# Altium project SC8701_EVM_RE1.PrjPcb
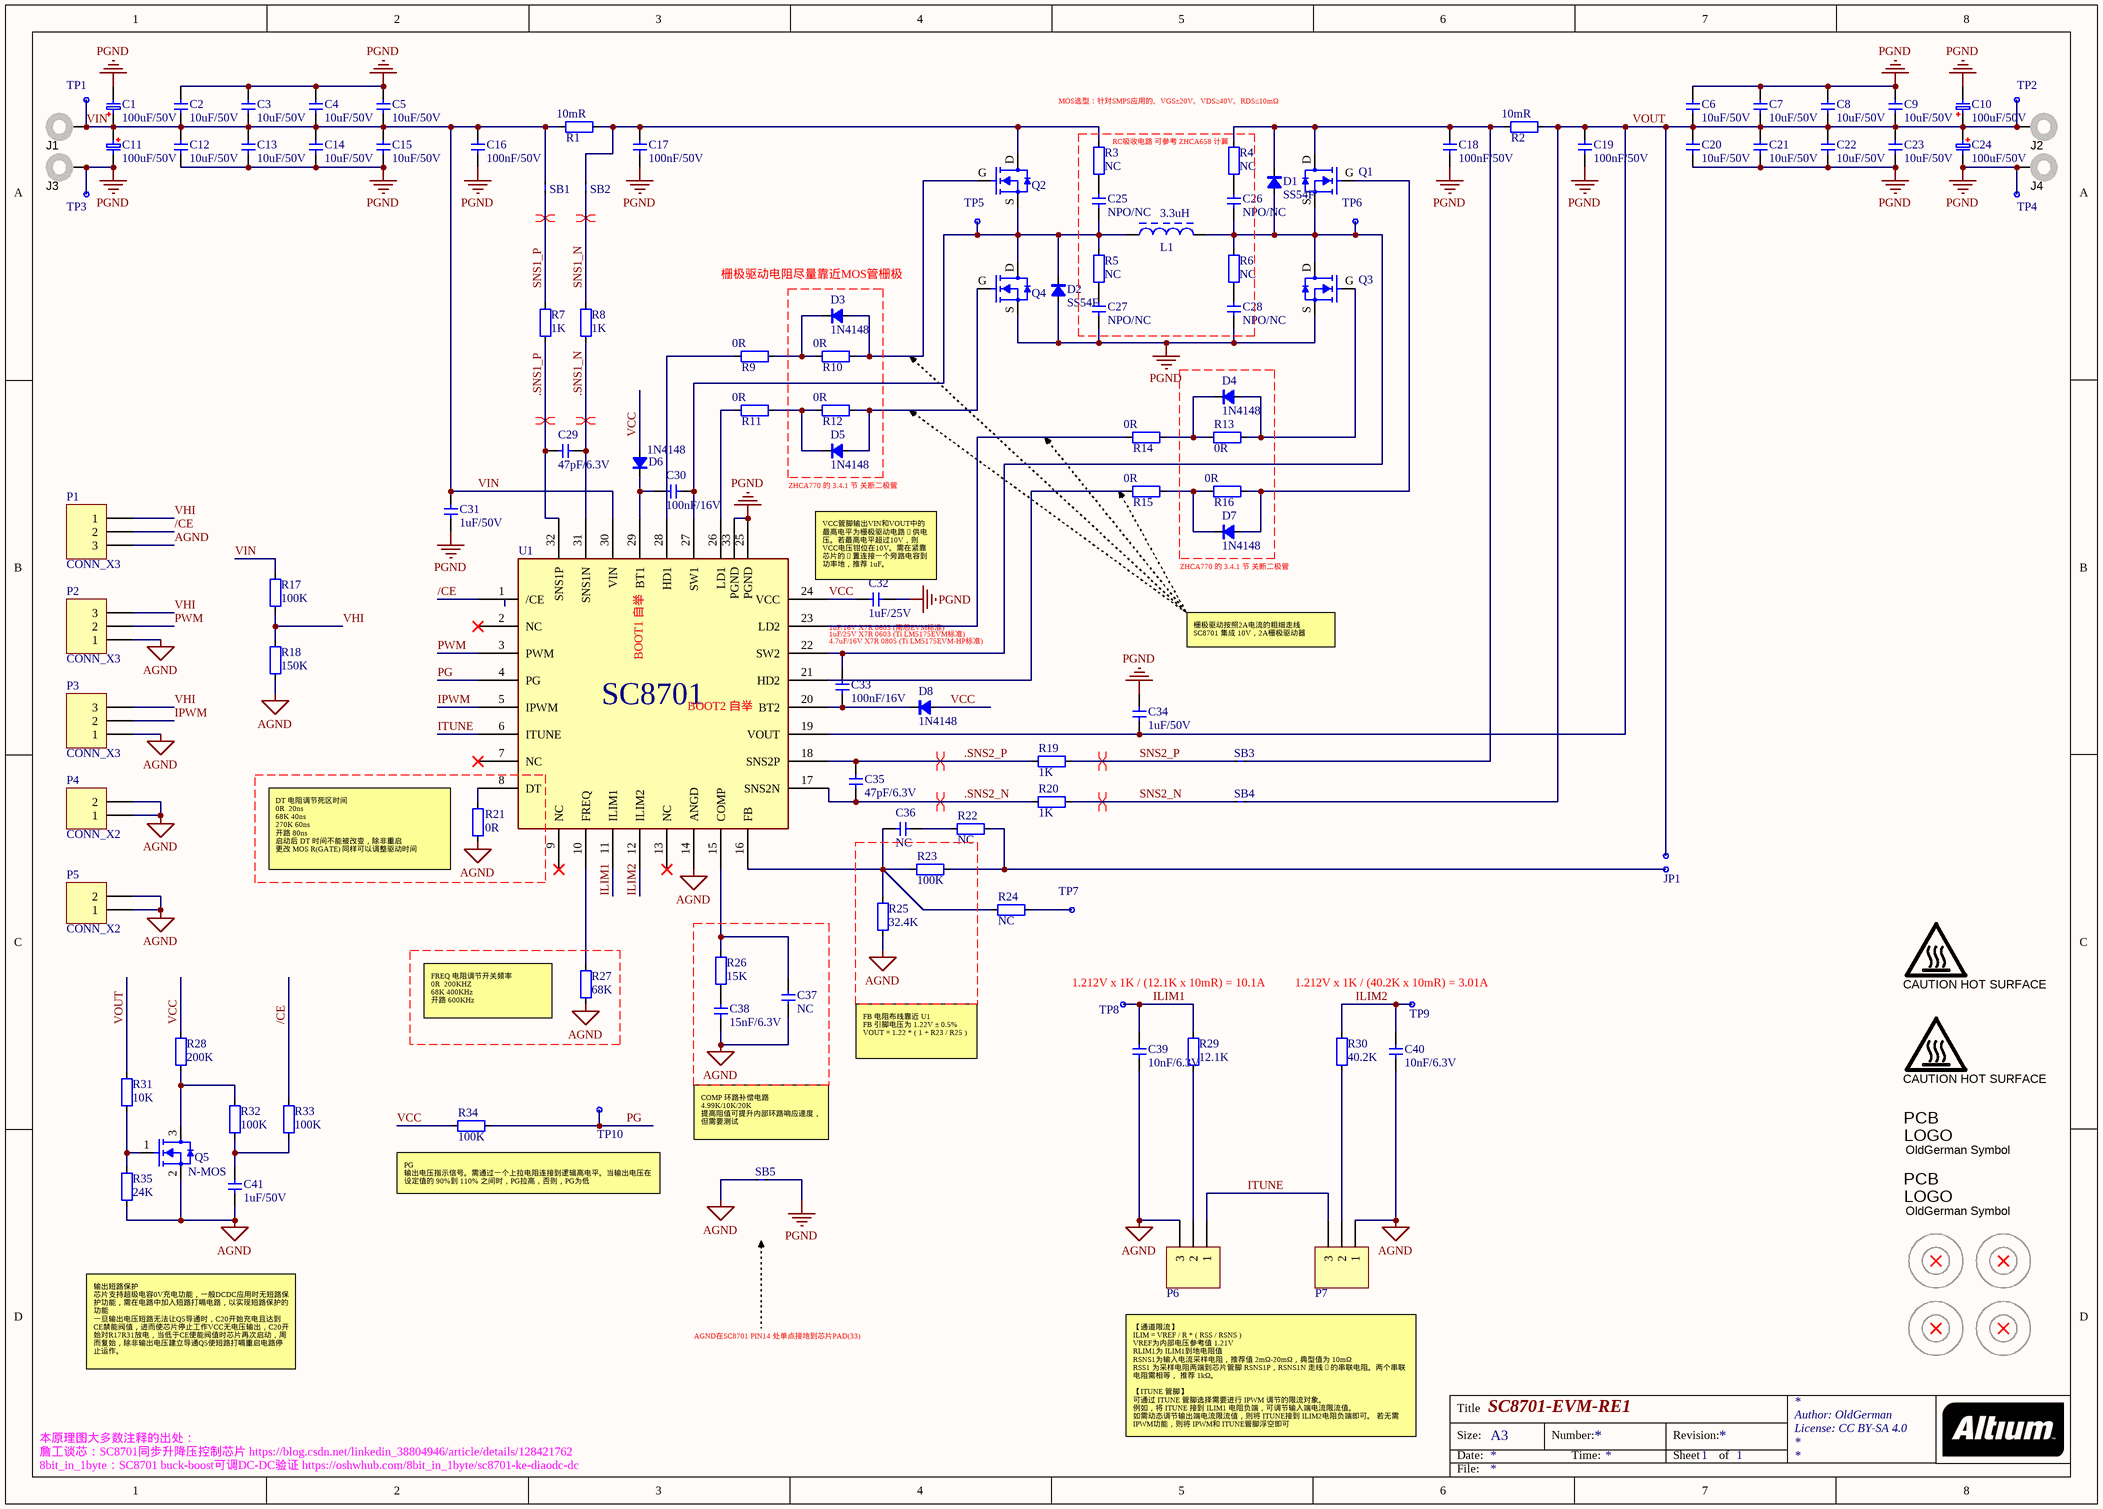
[diagram p0: SC8701_EVM_RE1_0624_M6.SchDoc]
1 sheet, 126 parts. Net scope: global (net labels, ports and power ports of the same name join across sheets).
Board file: SC8701_EVM_RE1_0624_M6.PcbDoc

## Sheet SC8701_EVM_RE1_0624_M6.SchDoc: SC8701-EVM-RE1
size A3; Address1: Author: OldGerman; Address2: License: CC BY-SA 4.0; SheetNumber: 1; SheetTotal: 1

### Parts
C1  100uF/50V  [CAP OS-CON D=10.0 L=10.0 F10]
C2  10uF/50V  [C1210]
C3  10uF/50V  [C1210]
C4  10uF/50V  [C1210]
C5  10uF/50V  [C1210]
C6  10uF/50V  [C1210]
C7  10uF/50V  [C1210]
C8  10uF/50V  [C1210]
C9  10uF/50V  [C1210]
C10  100uF/50V  [CAP OS-CON D=10.0 L=10.0 F10]
C11  100uF/50V  [CAP OS-CON D=10.0 L=10.0 F10]
C12  10uF/50V  [C1210]
C13  10uF/50V  [C1210]
C14  10uF/50V  [C1210]
C15  10uF/50V  [C1210]
C16  100nF/50V  [C0603]
C17  100nF/50V  [C0603]
C18  100nF/50V  [C0603]
C19  100nF/50V  [C0603]
C20  10uF/50V  [C1210]
C21  10uF/50V  [C1210]
C22  10uF/50V  [C1210]
C23  10uF/50V  [C1210]
C24  100uF/50V  [CAP OS-CON D=10.0 L=10.0 F10]
C25  NPO/NC  [C0805]
C26  NPO/NC  [C0805]
C27  NPO/NC  [C0805]
C28  NPO/NC  [C0805]
C29  47pF/6.3V  [C0603]
C30  100nF/16V  [C0603]
C31  1uF/50V  [C0603]
C32  1uF/25V  [C0805]
C33  100nF/16V  [C0603]
C34  1uF/50V  [C0603]
C35  47pF/6.3V  [C0603]
C36  NC  [C0603]
C37  NC  [C0603]
C38  15nF/6.3V  [C0603]
C39  10nF/6.3V  [C0603]
C40  10nF/6.3V  [C0603]
C41  1uF/50V  [C0603]
D1  SS54F  [SMAF]
D2  SS54F  [SMAF]
D3  1N4148  [SOD-323]
D4  1N4148  [SOD-323]
D5  1N4148  [SOD-323]
D6  1N4148  [SOD-323]
D7  1N4148  [SOD-323]
D8  1N4148  [SOD-323]
H1  HOLE  [M3.2 D=8]  (value not drawn)
H2  HOLE  [M3.2 D=8]  (value not drawn)
H3  HOLE  [M3.2 D=8]  (value not drawn)
H4  HOLE  [M3.2 D=8]  (value not drawn)
J1  U6047  [JACK_BANANA_4MM_M6_GE]  (value not drawn)
J2  U6047  [JACK_BANANA_4MM_M6_GE]  (value not drawn)
J3  U6047  [JACK_BANANA_4MM_M6_GE]  (value not drawn)
J4  U6047  [JACK_BANANA_4MM_M6_GE]  (value not drawn)
JP1  CONN_X2_DOT  [2.54mm_Male_x2]  (value not drawn)
L1  3.3uH  [INDUCTOR 1350 12.6X13.5X5.0mm]
LOGO1  CAUTION HOT SURFACE  [IEC_HotSurface_Small]  (no BOM)
LOGO2  CAUTION HOT SURFACE  [IEC_HotSurface_Small]  (no BOM)
Logo3  OldGerman Symbol  [ODG_LOGO]  (no BOM)
Logo4  OldGerman Symbol  [ODG_LOGO]  (no BOM)
P1  CONN_X3  [2.54mm_Male_x3]
P2  CONN_X3  [2.54mm_Male_x3]
P3  CONN_X3  [2.54mm_Male_x3]
P4  CONN_X2  [2.54mm_Male_x2]
P5  CONN_X2  [2.54mm_Male_x2]
P6  CONN_X3  [2.54mm_Male_x3]  (value not drawn)
P7  CONN_X3  [2.54mm_Male_x3]  (value not drawn)
Q1  N-MOS_GDS  [SO8FL ROUND]  (value not drawn)
Q2  N-MOS_GDS  [SO8FL ROUND]  (value not drawn)
Q3  N-MOS_GDS  [SO8FL ROUND]  (value not drawn)
Q4  N-MOS_GDS  [SO8FL ROUND]  (value not drawn)
Q5  N-MOS  [INFINEON SOT-23-3]
R1  10mR  [R1206]
R2  10mR  [R1206]
R3  NC  [R0805]
R4  NC  [R0805]
R5  NC  [R0805]
R6  NC  [R0805]
R7  1K  [R0603]
R8  1K  [R0603]
R9  0R  [R0603]
R10  0R  [R0603]
R11  0R  [R0603]
R12  0R  [R0603]
R13  0R  [R0603]
R14  0R  [R0603]
R15  0R  [R0603]
R16  0R  [R0603]
R17  100K  [R0603]
R18  150K  [R0603]
R19  1K  [R0603]
R20  1K  [R0603]
R21  0R  [R0603]
R22  NC  [R0603]
R23  100K  [R0603]
R24  NC  [R0603]
R25  32.4K  [R0603]
R26  15K  [R0603]
R27  68K  [R0603]
R28  200K  [R0603]
R29  12.1K  [R0603]
R30  40.2K  [R0603]
R31  10K  [R0603]
R32  100K  [R0603]
R33  100K  [R0603]
R34  100K  [R0603]
R35  24K  [R0603]
SB1  NetTie_200um  [NetTie_200um]  (value not drawn)  (net tie, no BOM)
SB2  NetTie_200um  [NetTie_200um]  (value not drawn)  (net tie, no BOM)
SB3  NetTie_200um  [NetTie_200um]  (value not drawn)  (net tie, no BOM)
SB4  NetTie_200um  [NetTie_200um]  (value not drawn)  (net tie, no BOM)
SB5  NetTie_200um  [NetTie_200um]  (value not drawn)  (net tie, no BOM)
TP1  CONN_X1_DOT  [2.54mm_Male_x1]  (value not drawn)
TP2  CONN_X1_DOT  [2.54mm_Male_x1]  (value not drawn)
TP3  CONN_X1_DOT  [2.54mm_Male_x1]  (value not drawn)
TP4  CONN_X1_DOT  [2.54mm_Male_x1]  (value not drawn)
TP5  CONN_X1_DOT  [2.54mm_Male_x1]  (value not drawn)
TP6  CONN_X1_DOT  [2.54mm_Male_x1]  (value not drawn)
TP7  CONN_X1_DOT  [2.54mm_Male_x1]  (value not drawn)
TP8  CONN_X1_DOT  [2.54mm_Male_x1]  (value not drawn)
TP9  CONN_X1_DOT  [2.54mm_Male_x1]  (value not drawn)
TP10  CONN_X1_DOT  [2.54mm_Male_x1]  (value not drawn)
U1  SC8701 (A)  [TQFN-32 4X4MM 0.4 VIA]  (value not drawn)

### Nets
AGND: C37.1 C38.1 C39.1 C40.1 C41.2 P1.3 P2.1 P3.1 P4.1 P4.2 P5.1 P5.2 P6.3 P7.1 Q5.2(S) R18.1 R21.1 R25.1 R27.1 R35.1 SB5.1 U1.14(ANGD)
PGND: C1.2 C2.1 C3.1 C4.1 C5.1 C6.1 C7.1 C8.1 C9.1 C10.2 C11.2 C12.1 C13.1 C14.1 C15.1 C16.1 C17.1 C18.1 C19.1 C20.1 C21.1 C22.1 C23.1 C24.2 C27.1 C28.1 C31.2 C32.2 C34.2 D2.1(A) J3.1 J4.1 Q3.S Q4.S SB5.2 TP3.1 TP4.1 U1.25(PGND) U1.33(PGND)
.SNS1_N: C29.2 R8.1 U1.31(SNS1N)
.SNS1_P: C29.1 R7.1 U1.32(SNS1P)
.SNS2_N: C35.2 R20.2 U1.17(SNS2N)
.SNS2_P: C35.1 R19.2 U1.18(SNS2P)
/CE: P1.2 R33.2 U1.1(/CE)
ILIM1: C39.2 R29.2 TP8.1 U1.11(ILIM1)
ILIM2: C40.2 R30.2 TP9.1 U1.12(ILIM2)
IPWM: P3.2 U1.5(IPWM)
ITUNE: P6.1 P7.3 U1.6(ITUNE)
PG: R34.2 TP10.1 U1.4(PG)
PWM: P2.2 U1.3(PWM)
SNS1_N: R8.2 SB2.1
SNS1_P: R7.2 SB1.1
SNS2_N: R20.1 SB4.1
SNS2_P: R19.1 SB3.1
VCC: C32.1 D6.1(A) D8.1(A) R28.2 R34.1 U1.24(VCC)
VHI: P1.1 P2.3 P3.3 R17.1 R18.2
VIN: C1.1 C2.2 C3.2 C4.2 C5.2 C11.1 C12.2 C13.2 C14.2 C15.2 C16.2 C31.1 J1.1 R1.1 R17.2 SB1.2 TP1.1 U1.30(VIN)
VOUT: C6.2 C7.2 C8.2 C9.2 C10.1 C19.2 C20.2 C21.2 C22.2 C23.2 C24.1 C34.1 J2.1 JP1.1 R2.2 R31.2 SB4.2 TP2.1 U1.19(VOUT)
NetC17_2: C17.2 Q2.D R1.2 R3.2 SB2.2
NetC18_2: C18.2 D1.2(C) Q1.D R2.1 R4.2 SB3.2
NetC25_1: C25.1 C30.2 D2.2(C) L1.1 Q2.S Q4.D R5.2 TP5.1 U1.27(SW1)
NetC25_2: C25.2 R3.1
NetC26_1: C26.1 C33.1 D1.1(A) L1.2 Q1.S Q3.D R6.2 TP6.1 U1.22(SW2)
NetC26_2: C26.2 R4.1
NetC27_2: C27.2 R5.1
NetC28_2: C28.2 R6.1
NetC30_1: C30.1 D6.2(C) U1.29(BT1)
NetC33_2: C33.2 D8.2(C) U1.20(BT2)
NetC36_1: C36.1 R23.1 R24.2 R25.2 U1.16(FB)
NetC36_2: C36.2 R22.2
NetC37_2: C37.2 R26.2 U1.15(COMP)
NetC38_2: C38.2 R26.1
NetC41_1: C41.1 R32.1 R33.1
NetD3_1: D3.1(A) Q2.G R10.2
NetD3_2: D3.2(C) R9.2 R10.1
NetD4_1: D4.1(A) Q3.G R13.2
NetD4_2: D4.2(C) R13.1 R14.2
NetD5_1: D5.1(A) Q4.G R12.2
NetD5_2: D5.2(C) R11.2 R12.1
NetD7_1: D7.1(A) Q1.G R16.2
NetD7_2: D7.2(C) R15.2 R16.1
NetJP1_2: JP1.2 R22.1 R23.2
NetP6_2: P6.2 R29.1
NetP7_2: P7.2 R30.1
NetQ5_1: Q5.1(G) R31.1 R35.2
NetQ5_3: Q5.3(D) R28.1 R32.2
NetR9_1: R9.1 U1.28(HD1)
NetR11_1: R11.1 U1.26(LD1)
NetR14_1: R14.1 U1.23(LD2)
NetR15_1: R15.1 U1.21(HD2)
NetR21_2: R21.2 U1.8(DT)
NetR24_1: R24.1 TP7.1
NetR27_2: R27.2 U1.10(FREQ)

Not connected (* = marked no-connect by the designer): H1 1*; H2 1*; H3 1*; H4 1*; U1 2(NC)* 7(NC)* 9(NC)* 13(NC)*

### Layout directives
differential pair: .SNS1_N, .SNS1_P, .SNS2_N, .SNS2_P, SNS1_N, SNS1_P, SNS2_N, SNS2_P

### Notes on the sheet
- MOS选型：针对SMPS应用的、VGS±20V、VDS≥40V、RDS≤10mΩ
- (near R3) RC吸收电路 可参考 ZHCA658 计算
- (near D3) 栅极驱动电阻尽量靠近MOS管栅极
- (near D5) ZHCA770 的 3.4.1 节 关断二极管
- VCC管脚输出VIN和VOUT中的最高电平为栅极驱动电路供电压。若最高电平超过10V，则VCC电压钳位在10V。需在紧靠芯片的置连接一个旁路电容到功率地，推荐 1uF。
- (near D7) ZHCA770 的 3.4.1 节 关断二极管
- 4.7uF/16V X7R 0805 (Ti LM5175EVM-HP标准)
- 1uF/25V X7R 0603 (Ti LM5175EVM标准)
- 1uF/16V X7R 0603 (南芯EVM标准)
- 栅极驱动按照2A电流的粗细走线
  SC8701 集成 10V，2A栅极驱动器
- (near U1) BOOT1 自举
- (near U1) BOOT2 自举
- (near R21) DT 电阻调节死区时间
  0R  20ns
  68K 40ns
  270K 60ns
  开路 80ns
  启动后 DT 时间不能被改变，除非重启
  更改 MOS R(GATE) 同样可以调整驱动时间
- (near TP8) 1.212V x 1K / (12.1K x 10mR) = 10.1A
- (near TP9) 1.212V x 1K / (40.2K x 10mR) = 3.01A
- (near R27) FREQ 电阻调节开关频率
  0R  200KHZ
  68K 400KHz
  开路 600KHz
- FB 电阻布线靠近 U1
  FB 引脚电压为 1.22V ± 0.5%
  VOUT = 1.22 * ( 1 + R23 / R25 )
- PG
  输出电压指示信号。需通过一个上拉电阻连接到逻辑高电平。当输出电压在设定值的 90%到 110% 之间时，PG拉高，否则，PG为低
- (near SB5) COMP 环路补偿电路
  4.99K/10K/20K
  提高阻值可提升内部环路响应速度，但需要测试
- 输出短路保护
  芯片支持超级电容0V充电功能，一般DCDC应用时无短路保护功能，需在电路中加入短路打嗝电路，以实现短路保护的功能
  一旦输出电压短路无法让Q5导通时，C20开始充电且达到CE禁能阀值，进而使芯片停止工作VCC无电压输出，C20开始对R17R31放电，当低于CE使能阀值时芯片再次启动，周而复始，除非输出电压建立导通Q5使短路打嗝重启电路停止运作。
- AGND在SC8701 PIN14 处单点接地到芯片PAD(33)
- 【通道限流】
  ILIM = VREF / R * ( RSS / RSNS )
  VREF为内部电压参考值 1.21V
  RLIM1为 ILIM1到地电阻值
  RSNS1为输入电流采样电阻，推荐值 2mΩ-20mΩ，典型值为 10mΩ
  RSS1 为采样电阻两端到芯片管脚 RSNS1P，RSNS1N 走线的串联电阻。两个串联电阻需相等， 推荐 1kΩ。
  【ITUNE 管脚】
  可通过 ITUNE 管脚选择需要进行 IPWM 调节的限流对象。
  例如，将 ITUNE 接到 ILIM1 电阻负端，可调节输入端电流限流值。
  如需动态调节输出端电流限流值，则将 ITUNE接到 ILIM2电阻负端即可。 若无需 IPWM功能，则将 IPWM和 ITUNE管脚浮空即可
- 本原理图大多数注释的出处：
  詹工谈芯：SC8701同步升降压控制芯片 https://blog.csdn.net/linkedin_38804946/article/details/128421762
  8bit_in_1byte：SC8701 buck-boost可调DC-DC验证 https://oshwhub.com/8bit_in_1byte/sc8701-ke-diaodc-dc
- Title
- Size:
- Date:
- A3
- Number:
- Time:
- Revision:
- Sheet
- of
- File:
- (in symbol OldGeman) PCB; LOGO
- (in symbol SC8701 (A)) SC8701

### Library data of the parts
C1 C10 C11 C24 = CAP_Polar_Aluminum: Capacitor
C2-C9 C12-C23 C25-C41 = CAP: Capacitor
D1-D8 = Diode: 二极管
J1-J4 = JACK_BANANA: Banana Jack; PartNumber: 575-8; Manufacturer: Keystone; CompType: Connector; U/M: EA; RoHS: Y; PackageReference: Keystone575-8; MountType: TH; ComponentLink1Description: Datasheet Link; ComponentLink1URL: http://www.keyelco.com/pdfs/M55p95.pdf; Publisher: Texas Instruments; LatestRevisionDate: 2015-08-25; Supplier 1: Digi-Key; Supplier Part Number 1: 36-575-8-ND
L1 = Inductor_power: 135 功率电感 额定电流15A
LOGO1 LOGO2 = IEC_HotSurface: IEC 61010-1 Hot Surface Warning; SymbolCreator: a0412235; SymbolVersion: 2011-08-22; Published: 2009-03-03; Publisher: Texas Instruments; LatestRevisionDate: 2014-11-20
Logo3 Logo4 = OldGeman: SymbolCreator: a0412235; SymbolVersion: 2011-08-22; Published: 2009-03-03; Publisher: Texas Instruments; LatestRevisionDate: 2014-11-20
Q5 = N-MOS_123
R1-R35 = RES: IEC Standard
SB1-SB5 = NetTie 0.2mm: Net Tie; Artikkelnr Noca: N.A.; Pad Count: 2; Part Number: NetTie 0.2mm; ComponentLink1Description: Datasheet; ComponentLink2Description: Supplier link; Footprint Doc: NetTie; LatestRevisionDate: 2019-10-07; Pin Count: 2; Publisher: Nordic Semiconductor; Published: 2019-10-07; Value: NetTie_200um; Part number IPS: N.A.; Component Class: Connectors; PartId: 100500654
U1 = SC8701 (A): 高效率, 同步, 4 管升降压控制器